# EAGLE schematic T04_Display (EAGLE 7.1.0)
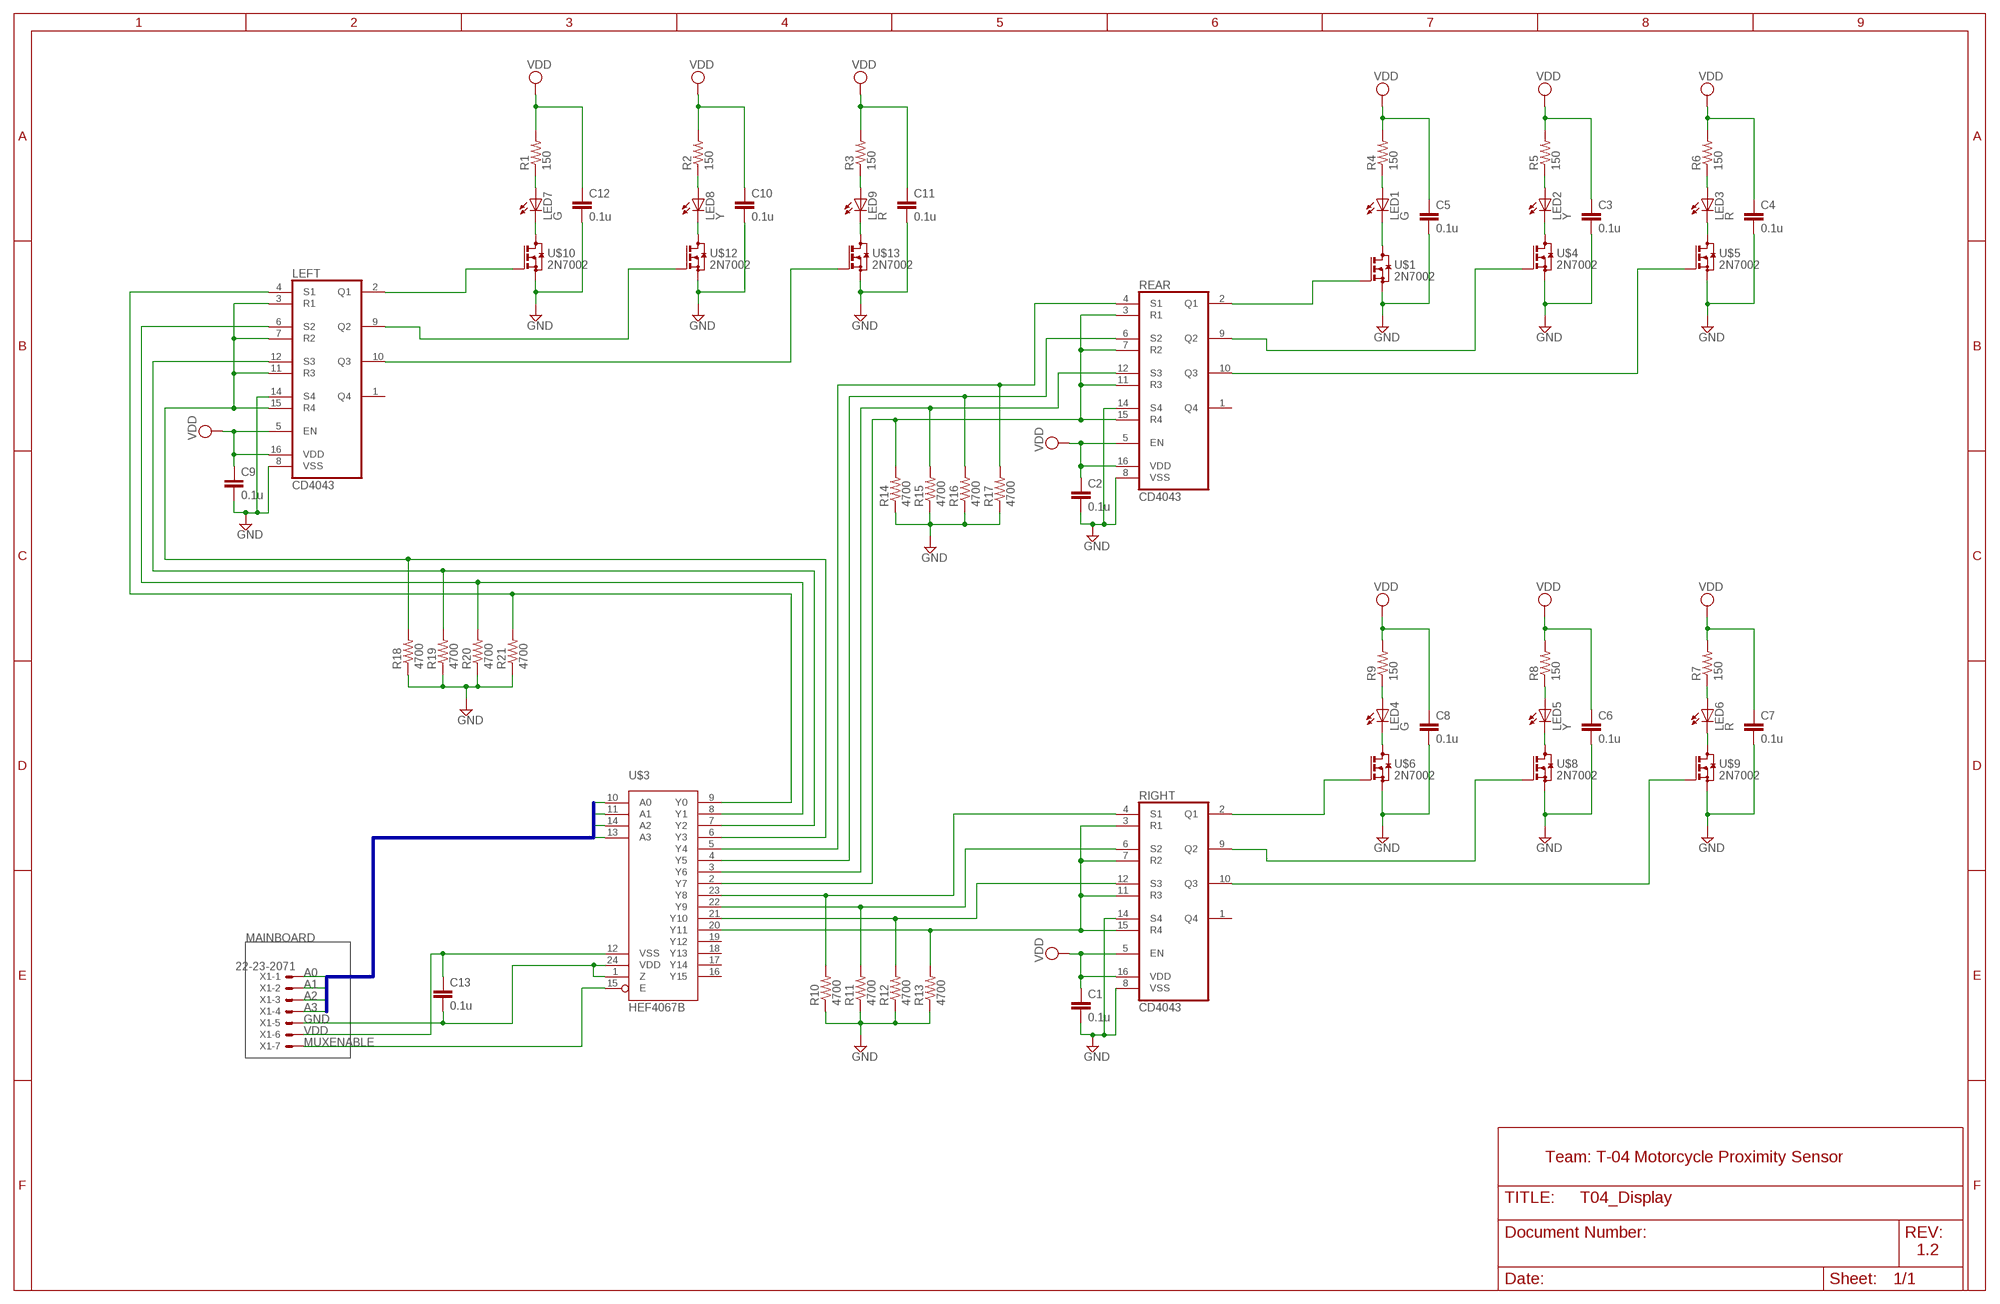
[diagram p0: schematic, sheet 1]

## Parts
C1  0.1u  C-EUC1206  [C1206]
C2  0.1u  C-EUC1206  [C1206]
C3  0.1u  C-EUC1206  [C1206]
C4  0.1u  C-EUC1206  [C1206]
C5  0.1u  C-EUC1206  [C1206]
C6  0.1u  C-EUC1206  [C1206]
C7  0.1u  C-EUC1206  [C1206]
C8  0.1u  C-EUC1206  [C1206]
C9  0.1u  C-EUC1206  [C1206]
C10  0.1u  C-EUC1206  [C1206]
C11  0.1u  C-EUC1206  [C1206]
C12  0.1u  C-EUC1206  [C1206]
C13  0.1u  C-EUC1206  [C1206]
LED1  G  LED3MM  [LED3MM]
LED2  Y  LED3MM  [LED3MM]
LED3  R  LED3MM  [LED3MM]
LED4  G  LED3MM  [LED3MM]
LED5  Y  LED3MM  [LED3MM]
LED6  R  LED3MM  [LED3MM]
LED7  G  LED3MM  [LED3MM]
LED8  Y  LED3MM  [LED3MM]
LED9  R  LED3MM  [LED3MM]
LEFT  CD4043  [SOIC16N]
R1  150  R-US_R1206  [R1206]
R2  150  R-US_R1206  [R1206]
R3  150  R-US_R1206  [R1206]
R4  150  R-US_R1206  [R1206]
R5  150  R-US_R1206  [R1206]
R6  150  R-US_R1206  [R1206]
R7  150  R-US_R1206  [R1206]
R8  150  R-US_R1206  [R1206]
R9  150  R-US_R1206  [R1206]
R10  4700  R-US_R1206  [R1206]
R11  4700  R-US_R1206  [R1206]
R12  4700  R-US_R1206  [R1206]
R13  4700  R-US_R1206  [R1206]
R14  4700  R-US_R1206  [R1206]
R15  4700  R-US_R1206  [R1206]
R16  4700  R-US_R1206  [R1206]
R17  4700  R-US_R1206  [R1206]
R18  4700  R-US_R1206  [R1206]
R19  4700  R-US_R1206  [R1206]
R20  4700  R-US_R1206  [R1206]
R21  4700  R-US_R1206  [R1206]
REAR  CD4043  [SOIC16N]
RIGHT  CD4043  [SOIC16N]
U$1  2N7002  [SOT23]
U$3  HEF4067B  [SO24W]
U$4  2N7002  [SOT23]
U$5  2N7002  [SOT23]
U$6  2N7002  [SOT23]
U$8  2N7002  [SOT23]
U$9  2N7002  [SOT23]
U$10  2N7002  [SOT23]
U$12  2N7002  [SOT23]
U$13  2N7002  [SOT23]
X1  22-23-2071  [22-23-2071]

## Nets
A0: U$3.10(A0) X1.1
A1: U$3.11(A1) X1.2
A2: U$3.14(A2) X1.3
A3: U$3.13(A3) X1.4
BG: LEFT.2(Q1) U$10.1(G)
BR: LEFT.10(Q3) U$13.1(G)
BRES: LEFT.3(R1) LEFT.7(R2) LEFT.11(R3) LEFT.15(R4) R18.2 U$3.6(Y3)
BS1: LEFT.4(S1) R21.2 U$3.9(Y0)
BS2: LEFT.6(S2) R20.2 U$3.8(Y1)
BS3: LEFT.12(S3) R19.2 U$3.7(Y2)
BY: LEFT.9(Q2) U$12.1(G)
GND: C1.2 C2.2 C3.2 C4.2 C5.2 C6.2 C7.2 C8.2 C9.2 C10.2 C11.2 C12.2 C13.1 LEFT.8(VSS) LEFT.14(S4) R10.1 R11.1 R12.1 R13.1 R14.1 R15.1 R16.1 R17.1 R18.1 R19.1 R20.1 R21.1 REAR.8(VSS) REAR.14(S4) RIGHT.8(VSS) RIGHT.14(S4) U$1.2(S) U$3.12(VSS) U$4.2(S) U$5.2(S) U$6.2(S) U$8.2(S) U$9.2(S) U$10.2(S) U$12.2(S) U$13.2(S) X1.6
LG: REAR.2(Q1) U$1.1(G)
LR: REAR.10(Q3) U$5.1(G)
LRES: R14.2 REAR.3(R1) REAR.7(R2) REAR.11(R3) REAR.15(R4) U$3.2(Y7)
LS1: R17.2 REAR.4(S1) U$3.5(Y4)
LS2: R16.2 REAR.6(S2) U$3.4(Y5)
LS3: R15.2 REAR.12(S3) U$3.3(Y6)
LY: REAR.9(Q2) U$4.1(G)
MUXENABLE: U$3.15(E) X1.7
N$1: LED3.K(C) U$5.3(D)
N$3: LED2.K(C) U$4.3(D)
N$4: LED1.K(C) U$1.3(D)
N$5: LED1.A R4.1
N$6: LED3.A R6.1
N$8: LED4.A R9.1
N$9: LED5.A R8.1
N$10: LED2.A R5.1
N$12: LED6.A R7.1
N$13: LED7.K(C) U$10.3(D)
N$14: LED7.A R1.1
N$15: LED8.K(C) U$12.3(D)
N$16: LED8.A R2.1
N$17: LED9.K(C) U$13.3(D)
N$18: LED9.A R3.1
N$21: LED6.K(C) U$9.3(D)
N$22: LED4.K(C) U$6.3(D)
N$23: LED5.K(C) U$8.3(D)
RG: RIGHT.2(Q1) U$6.1(G)
RR: RIGHT.10(Q3) U$9.1(G)
RRES: R13.2 RIGHT.3(R1) RIGHT.7(R2) RIGHT.11(R3) RIGHT.15(R4) U$3.20(Y11)
RS1: R10.2 RIGHT.4(S1) U$3.23(Y8)
RS2: R11.2 RIGHT.6(S2) U$3.22(Y9)
RS3: R12.2 RIGHT.12(S3) U$3.21(Y10)
RY: RIGHT.9(Q2) U$8.1(G)
VDD: C1.1 C2.1 C3.1 C4.1 C5.1 C6.1 C7.1 C8.1 C9.1 C10.1 C11.1 C12.1 C13.2 LEFT.5(EN) LEFT.16(VDD) R1.2 R2.2 R3.2 R4.2 R5.2 R6.2 R7.2 R8.2 R9.2 REAR.5(EN) REAR.16(VDD) RIGHT.5(EN) RIGHT.16(VDD) U$3.1(Z) U$3.24(VDD) X1.5
Unconnected: LEFT.1(Q4) REAR.1(Q4) RIGHT.1(Q4) U$3.16(Y15) U$3.17(Y14) U$3.18(Y13) U$3.19(Y12)

## Buses
A0,A1,A2,A3

## Notes on the sheet
- MAINBOARD
- Team: T-04 Motorcycle Proximity Sensor
- 1.2

## Library data of the parts
C1-C13 = resistor:C-EU: CAPACITOR, European symbol; SPICEPREFIX: C
LED1-LED9 = display:LED: LED OSRAM: - CHIPLED LG R971, LG N971, LY N971, LG Q971, LY Q971, LO R971, LY R971 LH N974, LH R974 LS Q976, LO Q976, LY Q976 LO Q996 - Hyper CHIPLED LW Q18S LB Q993, LB Q99A, LB R99A - SideLED LS A670, LO A670, LY A670, LG A670, LP A670 LB A673, LV A673, LT A673, LW A673 LH A674 LY A675 LS A676, LA A676, LO A676, LY A676, LW A676 LS A679, LY A679, LG A679 - Hyper Micro SIDELED® LS Y876, LA Y876, LO Y876, LY Y876 LT Y87S - SmartLED LW L88C, LW L88S LB L89C, LB L89S, LG L890 LS L89K, LO L89K, LY L89K LS L896, LA L896, LO L896, LY L896 - TOPLED LS T670, LO T670, LY T670, LG T670, LP T670 LSG T670, LSP T670, LSY T670, LOP T670, LYG T670 LG T671, LOG T671, LSG T671 LB T673, LV T673, LT T673, LW T673 LH T674 LS T676, LA T676, LO T676, LY T676, LB T676, LH T676, LSB T676, LW T676 LB T67C, LV T67C, LT T67C, LS T67K, LO T67K, LY T67K, LW E67C LS E67B, LA E67B, LO E67B, LY E67B, LB E67C, LV E67C, LT E67C LW T67C LS T679, LY T679, LG T679 LS T770, LO T770, LY T770, LG T770, LP T770 LB T773, LV T773, LT T773, LW T773 LH T774 LS E675, LA E675, LY E675, LS T675 LS T776, LA T776, LO T776, LY T776, LB T776 LHGB T686 LT T68C, LB T68C - Hyper Mini TOPLED® LB M676 - Mini TOPLED Santana® LG M470 LS M47K, LO M47K, LY M47K Source: http://www.osram.convergy.de LUXEON: - LUMILED® LXK2-PW12-R00, LXK2-PW12-S00, LXK2-PW14-U00, LXK2-PW14-V00 LXK2-PM12-R00, LXK2-PM12-S00, LXK2-PM14-U00 LXK2-PE12-Q00, LXK2-PE12-R00, LXK2-PE12-S00, LXK2-PE14-T00, LXK2-PE14-U00 LXK2-PB12-K00, LXK2-PB12-L00, LXK2-PB12-M00, LXK2-PB14-N00, LXK2-PB14-P00, LXK2-PB14-Q00 LXK2-PR12-L00, LXK2-PR12-M00, LXK2-PR14-Q00, LXK2-PR14-R00 LXK2-PD12-Q00, LXK2-PD12-R00, LXK2-PD12-S00 LXK2-PH12-R00, LXK2-PH12-S00 LXK2-PL12-P00, LXK2-PL12-Q00, LXK2-PL12-R00 Source: www.luxeon.com KINGBRIGHT: KA-3528ASYC Source: www.kingbright.com
LEFT REAR RIGHT = display:CD4043
R1-R21 = rcl:R-US_: RESISTOR, American symbol
U$1 U$4-U$6 U$8-U$10 U$12 U$13 = display:2N7002: 2N7002 nMOS
U$3 = display:HEF4067B
X1 = con-molex:22-23-2071: .100" (2.54mm) Center Header - 7 Pin; MF: MOLEX; MPN: 22-23-2071; OC_FARNELL: 1654534; OC_NEWARK: 56H0445